# EAGLE schematic zxuno_bus_v1 (EAGLE 7.2.0)
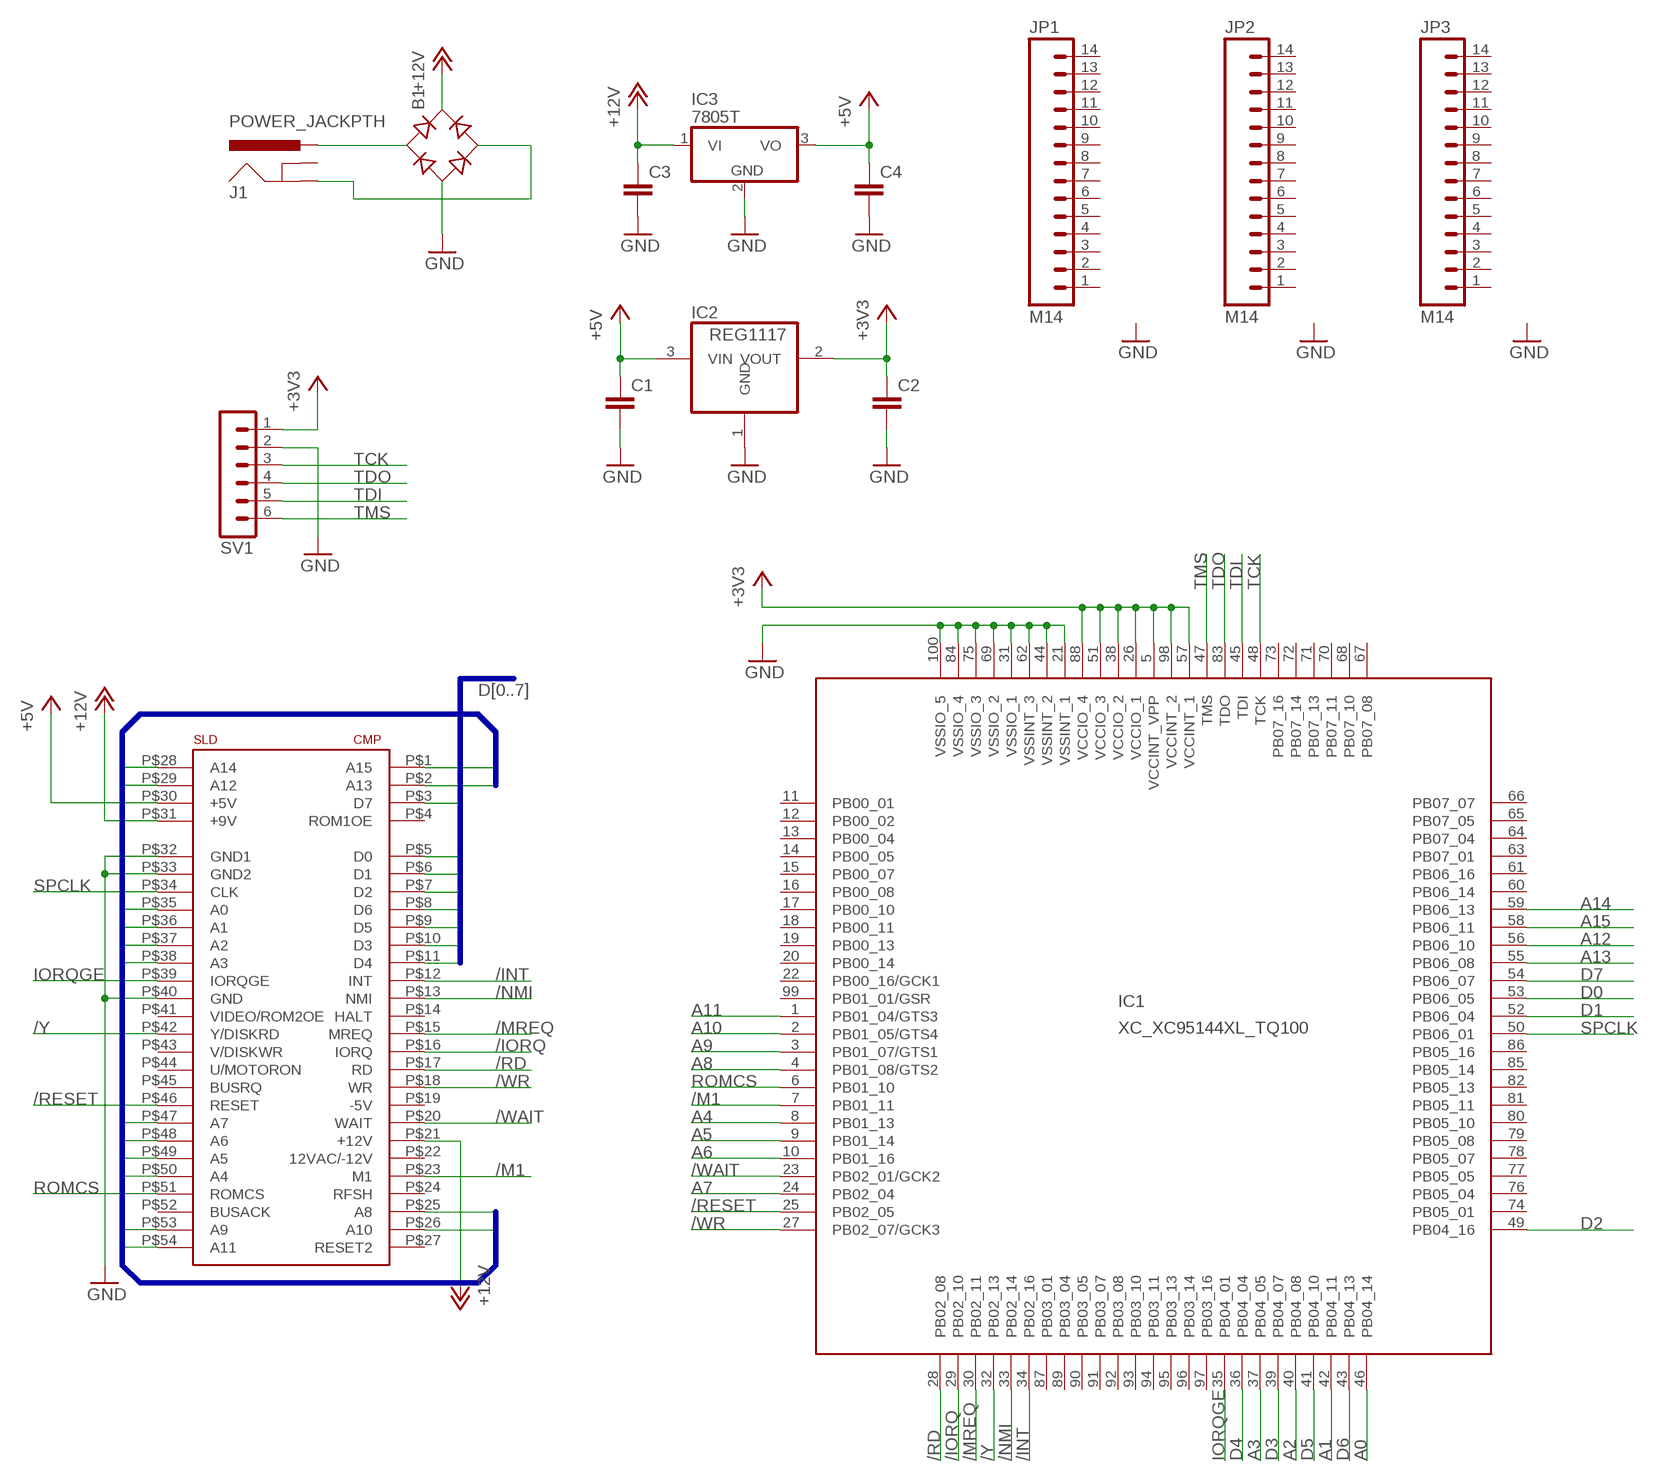
[diagram p0: schematic, sheet 1]

## Parts
B1  RB1A  [RB1A]
C1  C-EUC1206K  [C1206K]
C2  C-EUC1206K  [C1206K]
C3  C-EUC1206K  [C1206K]
C4  C-EUC1206K  [C1206K]
IC1  XC_XC95144XL_TQ100  [XC_XC-TQ100]
IC2  REG1117  [SOT223]
IC3  7805T  [TO220H]
J1  POWER_JACKPTH  [POWER_JACK_PTH]
JP1  M14  [1X14]
JP2  M14  [1X14]
JP3  M14  [1X14]
SV1  MA06-1  [MA06-1]
U$1  CONECTOR_EDGE_LADO_SPECTRUM  [CONECTOR_LADO_SPECTRUM]

## Nets
+3V3: C2.1 IC1.5(VCCINT_VPP) IC1.26(VCCIO_1) IC1.38(VCCIO_2) IC1.51(VCCIO_3) IC1.57(VCCINT_1) IC1.88(VCCIO_4) IC1.98(VCCINT_2) IC2.2(VOUT) SV1.1
+5V: C1.1 C4.1 IC2.3(VIN) IC3.3(VO) U$1.P$30(+5V)
+12V: B1.+ C3.1 IC3.1(VI) U$1.P$21(+12V) U$1.P$31(+9V)
/INT: IC1.34(PB02_16) U$1.P$12(INT)
/IORQ: IC1.29(PB02_10) U$1.P$16(IORQ)
/M1: IC1.7(PB01_11) U$1.P$23(M1)
/MREQ: IC1.30(PB02_11) U$1.P$15(MREQ)
/NMI: IC1.33(PB02_14) U$1.P$13(NMI)
/RD: IC1.28(PB02_08) U$1.P$17(RD)
/RESET: IC1.25(PB02_05) U$1.P$46(RESET)
/WAIT: IC1.23(PB02_01/GCK2) U$1.P$20(WAIT)
/WR: IC1.27(PB02_07/GCK3) U$1.P$18(WR)
/Y: IC1.32(PB02_13) U$1.P$42(Y/DISKRD)
A0: IC1.46(PB04_14) U$1.P$35(A0)
A1: IC1.42(PB04_11) U$1.P$36(A1)
A2: IC1.40(PB04_08) U$1.P$37(A2)
A3: IC1.37(PB04_05) U$1.P$38(A3)
A4: IC1.8(PB01_13) U$1.P$50(A4)
A5: IC1.9(PB01_14) U$1.P$49(A5)
A6: IC1.10(PB01_16) U$1.P$48(A6)
A7: IC1.24(PB02_04) U$1.P$47(A7)
A8: IC1.4(PB01_08/GTS2) U$1.P$25(A8)
A9: IC1.3(PB01_07/GTS1) U$1.P$53(A9)
A10: IC1.2(PB01_05/GTS4) U$1.P$26(A10)
A11: IC1.1(PB01_04/GTS3) U$1.P$54(A11)
A12: IC1.56(PB06_10) U$1.P$29(A12)
A13: IC1.55(PB06_08) U$1.P$2(A13)
A14: IC1.59(PB06_13) U$1.P$28(A14)
A15: IC1.58(PB06_11) U$1.P$1(A15)
D0: IC1.53(PB06_05) U$1.P$5(D0)
D1: IC1.52(PB06_04) U$1.P$6(D1)
D2: IC1.49(PB04_16) U$1.P$7(D2)
D3: IC1.39(PB04_07) U$1.P$10(D3)
D4: IC1.36(PB04_04) U$1.P$11(D4)
D5: IC1.41(PB04_10) U$1.P$9(D5)
D6: IC1.43(PB04_13) U$1.P$8(D6)
D7: IC1.54(PB06_07) U$1.P$3(D7)
GND: B1.- C1.2 C2.2 C3.2 C4.2 IC1.21(VSSINT_1) IC1.31(VSSIO_1) IC1.44(VSSINT_2) IC1.62(VSSINT_3) IC1.69(VSSIO_2) IC1.75(VSSIO_3) IC1.84(VSSIO_4) IC1.100(VSSIO_5) IC2.1(GND) IC3.2(GND) SV1.2 U$1.P$32(GND1) U$1.P$33(GND2) U$1.P$40(GND)
IORQGE: IC1.35(PB04_01) U$1.P$39(IORQGE)
N$1: B1.AC1 J1.PWR
N$2: B1.AC2 J1.GND
ROMCS: IC1.6(PB01_10) U$1.P$51(ROMCS)
SPCLK: IC1.50(PB06_01) U$1.P$34(CLK)
TCK: IC1.48(TCK) SV1.3
TDI: IC1.45(TDI) SV1.5
TDO: IC1.83(TDO) SV1.4
TMS: IC1.47(TMS) SV1.6
Unconnected: IC1.11(PB00_01) IC1.12(PB00_02) IC1.13(PB00_04) IC1.14(PB00_05) IC1.15(PB00_07) IC1.16(PB00_08) IC1.17(PB00_10) IC1.18(PB00_11) IC1.19(PB00_13) IC1.20(PB00_14) IC1.22(PB00_16/GCK1) IC1.60(PB06_14) IC1.61(PB06_16) IC1.63(PB07_01) IC1.64(PB07_04) IC1.65(PB07_05) IC1.66(PB07_07) IC1.67(PB07_08) IC1.68(PB07_10) IC1.70(PB07_11) IC1.71(PB07_13) IC1.72(PB07_14) IC1.73(PB07_16) IC1.74(PB05_01) IC1.76(PB05_04) IC1.77(PB05_05) IC1.78(PB05_07) IC1.79(PB05_08) IC1.80(PB05_10) IC1.81(PB05_11) IC1.82(PB05_13) IC1.85(PB05_14) IC1.86(PB05_16) IC1.87(PB03_01) IC1.89(PB03_04) IC1.90(PB03_05) IC1.91(PB03_07) IC1.92(PB03_08) IC1.93(PB03_10) IC1.94(PB03_11) IC1.95(PB03_13) IC1.96(PB03_14) IC1.97(PB03_16) IC1.99(PB01_01/GSR) J1.GNDBREAK JP1.1 JP1.2 JP1.3 JP1.4 JP1.5 JP1.6 JP1.7 JP1.8 JP1.9 JP1.10 JP1.11 JP1.12 JP1.13 JP1.14 JP2.1 JP2.2 JP2.3 JP2.4 JP2.5 JP2.6 JP2.7 JP2.8 JP2.9 JP2.10 JP2.11 JP2.12 JP2.13 JP2.14 JP3.1 JP3.2 JP3.3 JP3.4 JP3.5 JP3.6 JP3.7 JP3.8 JP3.9 JP3.10 JP3.11 JP3.12 JP3.13 JP3.14 U$1.P$4(ROM1OE) U$1.P$14(HALT) U$1.P$19(-5V) U$1.P$22(12VAC/-12V) U$1.P$24(RFSH) U$1.P$27(RESET2) U$1.P$41(VIDEO/ROM2OE) U$1.P$43(V/DISKWR) U$1.P$44(U/MOTORON) U$1.P$45(BUSRQ) U$1.P$52(BUSACK)

## Buses
D[0..7]
A[0..15]

## Library data of the parts
B1 = rectifier:RB1A: RECTIFIER 1 A
C1-C4 = rcl:C-EU: CAPACITOR, European symbol
IC1 = xilinx:XC_XC95144XL_TQ100: xc95144xl_tq100 edit this description Auto generated by make-symbol-device-package-bsdl.ulp Rev. 34 Source: xc95144xl_tq100.bsd
IC2 = burr-brown:REG1117: 800mA and 1A Low Dropout (LDO) Positive Regulator 1.8V, 2.5V, 2.85V, 3.3V, 5V, and Adj
IC3 = linear:78*: Positive VOLTAGE REGULATOR Source: http://cache.national.com/ds/LM/LM78L05.pdf http://www.fairchildsemi.com/ds/LM/LM7805.pdf
J1 = SparkFun:POWER_JACK: Power Jack This is the standard 5.5mm barrel jack for power. The PTH is the most common, proven, reliable, footprint. All others are experimental. The Slot footprint only works if the mill layer is transmitted to the PCB fab house so be warned. Spark Fun Electronics SKU : PRT-00119. Mating wall wart : TOL-00298 (and others)
JP1-JP3 = SparkFun:M14: Header 14 Standard 14-pin 0.1" header. Use with straight break away headers (SKU : PRT-00116), right angle break away headers (PRT-00553), swiss pins (PRT-00743), machine pins (PRT-00117), and female headers (PRT-00115).
SV1 = con-lstb:MA06-1: PIN HEADER
U$1 = zx_spectrum:CONECTOR_EDGE_LADO_SPECTRUM

## Net classes
0 default: width 0.178 mm, clearance 0.178 mm
1 power: width 0.305 mm, clearance 0.178 mm to class 0, clearance 0.229 mm